# EAGLE design mister_patch (EAGLE 9.0.0)
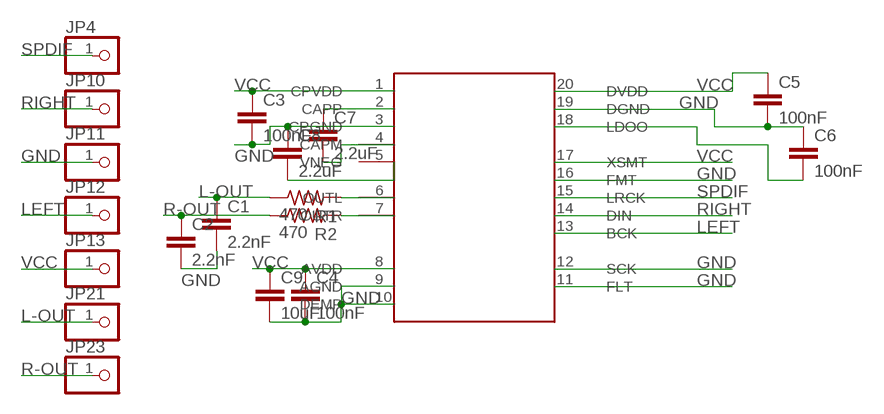
[diagram p0: schematic, sheet 1]

## Parts
C1  2.2nF  C-EUC0603K  [C0603K]
C2  2.2nF  C-EUC0603K  [C0603K]
C3  100nF  C-EUC0603K  [C0603K]
C4  100nF  C-EUC0603K  [C0603K]
C5  100nF  C-EUC0603K  [C0603K]
C6  100nF  C-EUC0603K  [C0603K]
C7  2.2uF  C-EUC0603K  [C0603K]
C8  2.2uF  C-EUC0603K  [C0603K]
C9  10uF  C-EUC0603K  [C0603K]
JP4  PINHD-1X1  [1X01]
JP10  PINHD-1X1  [1X01]
JP11  PINHD-1X1  [1X01]
JP12  PINHD-1X1  [1X01]
JP13  PINHD-1X1  [1X01]
JP21  PINHD-1X1  [1X01]
JP23  PINHD-1X1  [1X01]
R1  470  R-US_R0603  [R0603]
R2  470  R-US_R0603  [R0603]
U$1  PCM5102  [TSSOP20]

## Nets
GND [power]: C1.2 C2.2 C3.2 C4.2 C5.2 C6.1 C8.1 C9.2 JP11.1 U$1.3(CPGND) U$1.9(AGND) U$1.10(DEMP) U$1.11(FLT) U$1.12(SCK) U$1.16(FMT) U$1.19(DGND)
L-OUT: C1.1 JP21.1 R1.1
LEFT: JP12.1 U$1.13(BCK)
N$7: C8.2 U$1.5(VNEG)
N$9: C7.2 U$1.4(CAPM)
N$10: C7.1 U$1.2(CAPP)
N$11: R1.2 U$1.6(OUTL)
N$12: R2.2 U$1.7(OUTR)
N$14: C6.2 U$1.18(LDOO)
R-OUT: C2.1 JP23.1 R2.1
RIGHT: JP10.1 U$1.14(DIN)
SPDIF: JP4.1 U$1.15(LRCK)
VCC: C3.1 C4.1 C5.1 C9.1 JP13.1 U$1.1(CPVDD) U$1.8(AVDD) U$1.17(XSMT) U$1.20(DVDD)

## Library data of the parts
C1-C9 = rcl:C-EU: CAPACITOR, European symbol; SPICEPREFIX: C
JP4 JP10-JP13 JP21 JP23 = pinhead:PINHD-1X1: PIN HEADER
R1 R2 = rcl:R-US_: RESISTOR, American symbol
U$1 = adafruit:PCM5102

## Net classes
0 default: width 0.178 mm, clearance 0.178 mm
1 power: width 0.305 mm, clearance 0.178 mm to class 0, clearance 0.229 mm

## Board
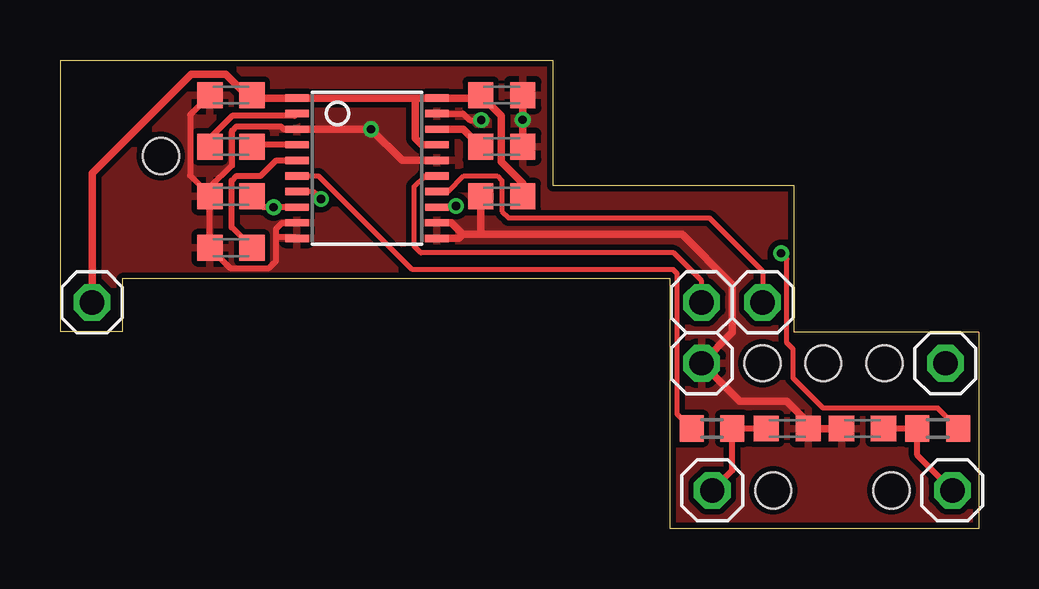
[diagram p1: board, top side]
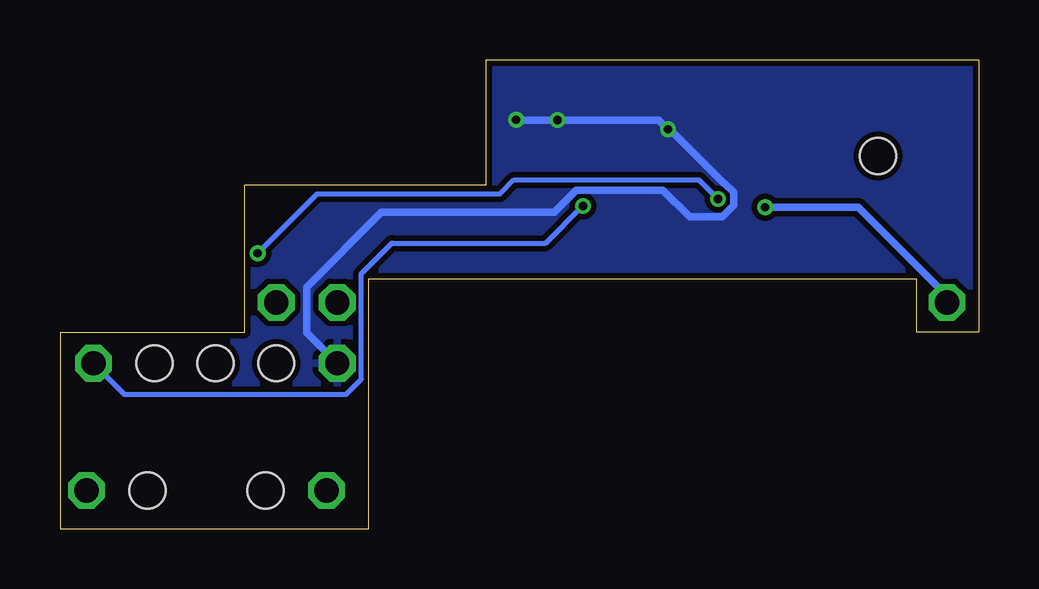
[diagram p2: board, bottom side, seen from below]

Size 38.29 x 19.53 mm. Coordinates in mm from the lower left corner, seen from the top.
Outline: 0,19.53 20.54,19.53 20.54,14.31 30.59,14.31 30.59,8.18 38.29,8.18 38.29,0 25.43,0 25.43,10.41 2.6,10.41 2.6,8.22 0,8.22 0,19.53
Copper layers (1*16): Top 0.035mm / dielectric 1.5mm / Bottom 0.035mm
Design rules "seedstudio_Fusion_eagle_rule_v1.1": minimum track width 6mil, minimum drill 12mil, track to track 6mil, track to pad 6mil, pad to pad 6mil, via to via 6mil, smd to smd 0mil, copper to edge 10mil, drill to drill 10mil, minimum pad ring 10mil, minimum via ring 6mil, stop-mask expansion 2mil, vias tented up to drill 100mil, thermal gap 10mil
Holes 1.5 mm at 29.27,6.9 31.8,6.9 34.35,6.9 4.2,15.53 29.72,1.6 34.65,1.6

### Footprints (pad centres in the part's own frame; a part is rotated, then mirrored left to right if it is on the bottom)
C0603K = smd 1.05 x 1.08: 1 -0.875,0; 2 0.875,0
1X01 = drill 1.016 octagon: 1 0,0
R0603 = smd 1 x 1.1: 1 -0.85,0; 2 0.85,0
TSSOP20 = smd 0.305 x 0.991: 1 -2.925,-2.918; 2 -2.275,-2.918; 3 -1.625,-2.918; 4 -0.975,-2.918; 5 -0.325,-2.918; 6 0.325,-2.918; 7 0.975,-2.918; 8 1.625,-2.918; 9 2.275,-2.918; 10 2.925,-2.918; 11 2.925,2.918; 12 2.275,2.918; 13 1.625,2.918; 14 0.975,2.918; 15 0.325,2.918; 16 -0.325,2.918; 17 -0.975,2.918; 18 -1.625,2.918; 19 -2.275,2.918; 20 -2.925,2.918

### Placement (x,y rotation side)
C1  30.3,4.18 0 top
C2  33.44,4.18 180 top
C3  7.12,13.86 180 top
C4  18.4,13.86 180 top
C5  18.4,18.07 0 top
C6  18.4,15.93 180 top
C7  7.12,15.93 0 top
C8  7.12,11.71 0 top
C9  7.12,18.07 180 top
JP4  26.73,9.44 0 top
JP10  29.27,9.44 0 top
JP11  26.73,6.9 0 top
JP12  36.89,6.9 0 top
JP13  1.33,9.44 0 top
JP21  27.18,1.6 0 top
JP23  37.19,1.6 0 top
R1  27.17,4.18 180 top
R2  36.58,4.18 0 top
U$1  12.79,15.02 270 top

### Tracks (layer width: path | path; a pad name or v marks a point on that pad's centre or on a via)
GND  (via drill 0.35)
  Top 0.254: U$1.3 9.32,16.65 9.2,16.77 7.35,16.77 7.17,16.59 7.17,15.15 6.25,14.22 6.25,13.89 | U$1.9 9.26,12.75 9,12.5 9,12.14 | 9,12.14 9,11.16 8.71,10.86 7.09,10.86 C8.1 C3.2 6.25,13.89 | U$1.10 9.83,12.14 9,12.14 | C9.2 5.42,17.24 5.42,14.72 6.25,13.89 | U$1.19 16.8,17.3 17.08,17.02 v17.55,17.02 v17.55,17.03
  Top 0.305: C2.2 C1.2 31.18,4.42 30.29,5.31 28.32,5.31 JP11.1 28.02,8.18 28.02,10.17 25.92,12.27 17.51,12.27 | U$1.12 16.3,12.75 16.78,12.27 | 17.51,12.27 16.78,12.27 | U$1.11 16.61,12.1 16.78,12.27 | C4.2 17.53,12.28 17.51,12.27 | C6.1 v19.28,17.04 C5.2 | U$1.16 14.25,15.35 v12.95,16.65 U$1.3
  Bottom 0.254: 12.92,16.69 v12.95,16.66 v12.95,16.65 | 19.26,17.03 v19.28,17.04
  Bottom 0.305: JP11.1 28,8.17 28,10.07 24.89,13.18 17.69,13.18 16.77,14.11 13.17,14.11 12.05,12.99 10.7,12.99 10.21,13.47 10.21,14.02 10.6,14.4 10.64,14.4 12.92,16.69 | v12.95,16.65 13.33,17.03 v17.55,17.03 19.26,17.03
  pour Top: 38.15,19.57 38.15,0.27 0.2,0.23 0.2,19.29
  pour Bottom: 38.19,19.57 38.11,0.23 0.17,0.19 0.24,19.29
L-OUT
  Top 0.254: C1.1 R1.1 28.02,2.44 JP21.1
LEFT  (via drill 0.35)
  Top 0.203: v16.5,13.45 16.45,13.4 U$1.13
  Bottom 0.203: JP12.1 35.6,5.6 26.37,5.6 25.73,6.24 25.73,10.63 24.46,11.9 18.05,11.9 v16.5,13.45
N$7
  Top 0.254: C8.2 7.15,12.56 7.15,14.5 7.35,14.7 8.36,14.7 9.01,15.35 U$1.5
N$9
  Top 0.254: U$1.4 8.07,16 C7.2
N$10
  Top 0.254: U$1.2 9.77,17.2 7.17,17.2 6.25,16.28 C7.1
N$11
  Top 0.203: R1.2 25.72,4.78 25.72,10.63 25.55,10.79 14.68,10.79 10.78,14.7 U$1.6
N$12  (via drill 0.35)
  Top 0.203: R2.2 36.58,5.03 31.8,5.03 30.55,6.28 30.55,7.49 30.29,7.75 30.29,11.24 v30.05,11.48 | v10.87,13.75 10.57,14.05 U$1.7
  Bottom 0.203: v30.05,11.48 27.57,13.96 19.95,13.96 19.37,14.54 11.66,14.54 v10.87,13.75
N$14
  Top 0.305: C6.2 16.8,16.65 U$1.18
R-OUT
  Top 0.254: JP23.1 35.73,3.06 R2.1 C2.1
RIGHT
  Top 0.203: JP10.1 29.27,10.73 27.05,12.95 18.69,12.95 18.42,13.23 18.42,14.5 18.21,14.71 16.83,14.71 16.17,14.05 U$1.14
SPDIF
  Top 0.203: JP4.1 26.73,10.32 25.57,11.49 15.04,11.49 14.76,11.77 14.76,14.26 15.19,14.7 U$1.15
VCC  (via drill 0.35)
  Top 0.254: U$1.8 v8.9,13.4 8.46,13.4 C3.1
  Top 0.305: C4.1 19.28,14.39 18.38,15.29 18.38,17.22 C5.1 17.4,17.95 U$1.20 14.8,17.95 | U$1.17 15.07,16 14.8,16.27 14.8,17.95 | 14.8,17.95 U$1.1 8.12,17.95 C9.1 7.78,18.07 6.91,18.94 5.47,18.94 1.33,14.81 JP13.1
  Bottom 0.305: JP13.1 1.33,9.72 2.44,10.82 2.45,10.82 5.03,13.4 v8.9,13.4